# EAGLE design esc_interface (EAGLE 7.5.0)
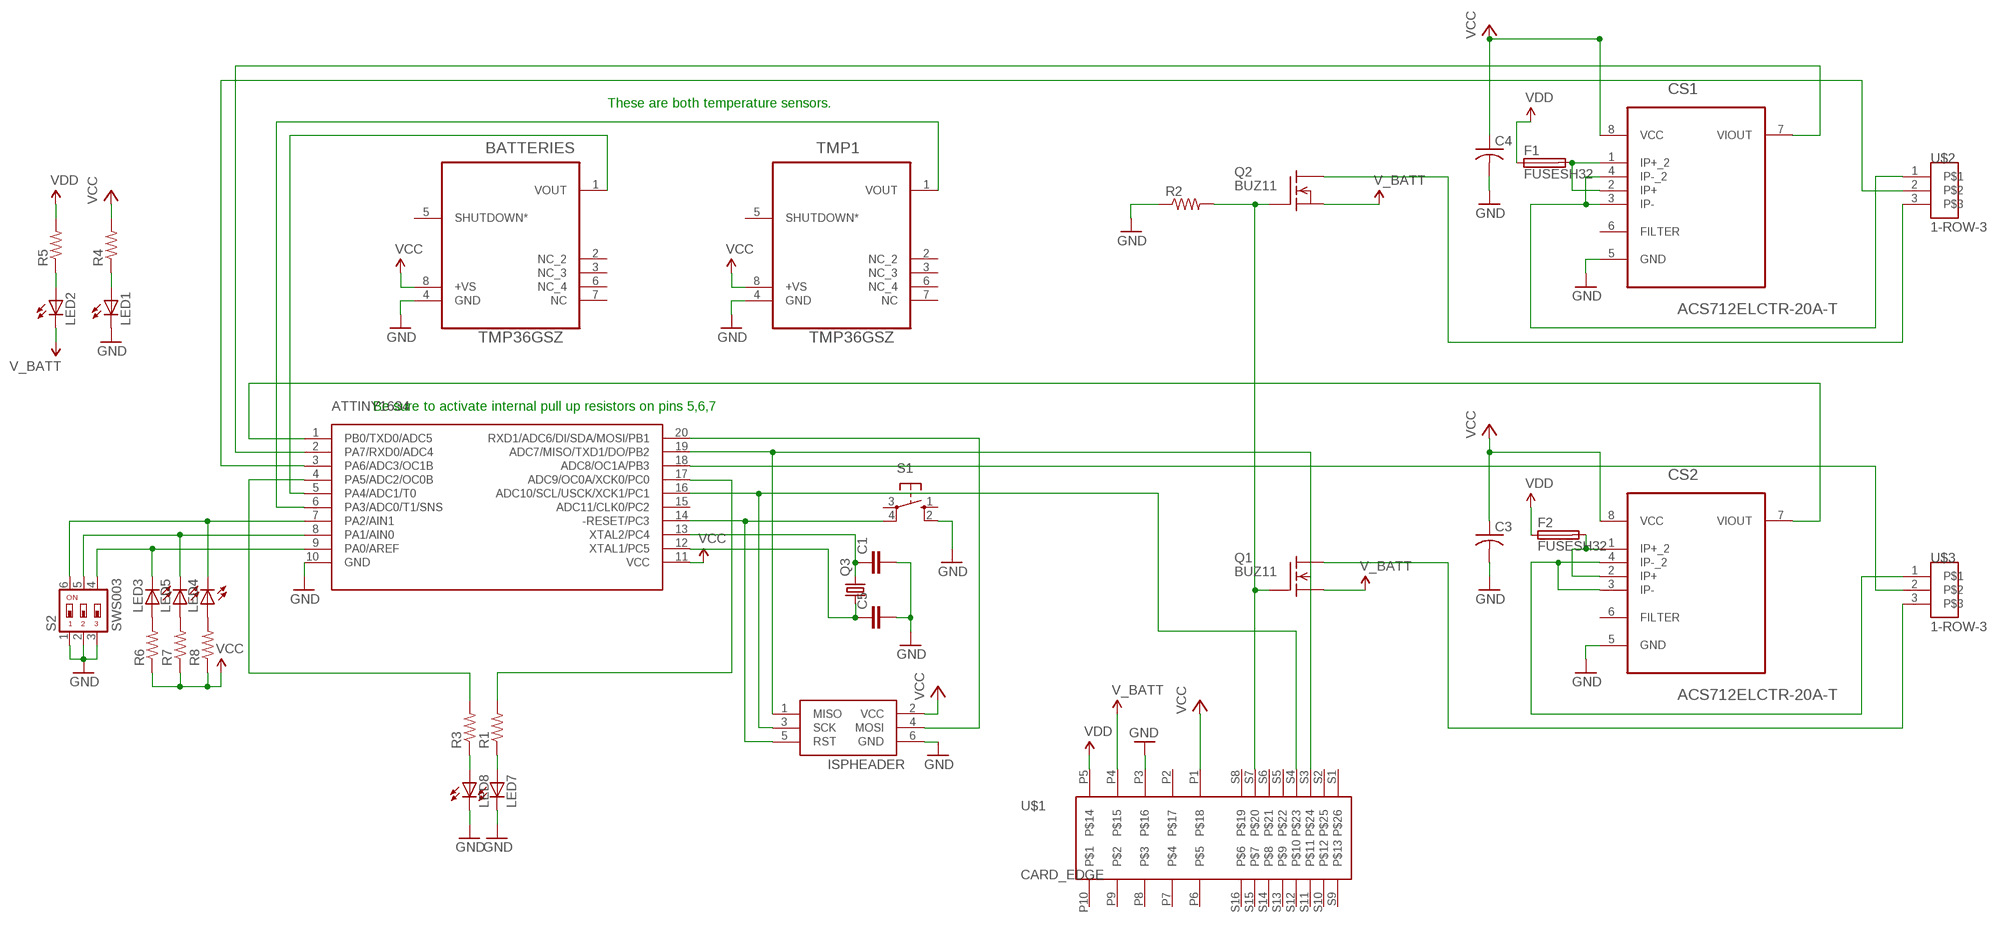
[diagram p0: schematic, sheet 1]

## Parts
ATTINY1634  ATTINY1634SOIC20  [SOIC20]
BATTERIES  TMP36GSZ  [SOIC127P600X175-8N]
C1  0.1UF-50V-20%(PTH)KIT-EZ  [CAP-PTH-SMALL-KIT]
C3  C-US025-030X050  [C025-030X050]
C4  C-US025-030X050  [C025-030X050]
C5  0.1UF-50V-20%(PTH)KIT-EZ  [CAP-PTH-SMALL-KIT]
CS1  ACS712ELCTR-20A-T  [SOIC127P600X175-8N]
CS2  ACS712ELCTR-20A-T  [SOIC127P600X175-8N]
F1  FUSESH32  [SH32]
F2  FUSESH32  [SH32]
ISPHEADER  AVRISP-6  [AVRISP]
LED1  LEDCHIP-LED0805  [CHIP-LED0805]
LED2  LEDCHIP-LED0805  [CHIP-LED0805]
LED3  LEDCHIP-LED0805  [CHIP-LED0805]
LED4  LEDCHIP-LED0805  [CHIP-LED0805]
LED5  LEDCHIP-LED0805  [CHIP-LED0805]
LED7  LEDCHIP-LED0805  [CHIP-LED0805]
LED8  LEDCHIP-LED0805  [CHIP-LED0805]
Q1  BUZ11  [TO220]
Q2  BUZ11  [TO220]
Q3  CRYSTALHC49S  [HC49/S]
R1  R-US_M2012  [M2012]
R2  R-US_M2012  [M2012]
R3  R-US_M2012  [M2012]
R4  R-US_M2012  [M2012]
R5  R-US_M2012  [M2012]
R6  R-US_M2012  [M2012]
R7  R-US_M2012  [M2012]
R8  R-US_M2012  [M2012]
S1  10-XX  [B3F-10XX]
S2  SWS003  [SMS-003]
TMP1  TMP36GSZ  [SOIC127P600X175-8N]
U$1  CARD_EDGE  [EDGE_CONNECTOR]
U$2  1-ROW-3  [1-ROW]
U$3  1-ROW-3  [1-ROW]

## Nets
GND: ATTINY1634.10(GND) BATTERIES.4(GND) C1.2 C3.2 C4.2 C5.2 CS1.5(GND) CS2.5(GND) ISPHEADER.6(GND) LED1.C LED7.C LED8.C R2.1 S1.2(S1) S2.1 S2.2 S2.3 TMP1.4(GND) U$1.P3
N$1: ATTINY1634.17(ADC9/OC0A/XCK0/PC0) R1.2
N$2: Q1.1(G) Q2.1(G) R2.2 U$1.S7
N$3: ATTINY1634.4(PA5/ADC2/OC0B) R3.2
N$4: Q1.2(D) U$3.3
N$5: Q2.2(D) U$2.3
N$6: ATTINY1634.19(ADC7/MISO/TXD1/DO/PB2) ISPHEADER.1(MISO) U$1.S3
N$7: CS2.3(IP-) CS2.4(IP-_2) U$3.1
N$8: ATTINY1634.1(PB0/TXD0/ADC5) CS2.7(VIOUT)
N$9: ATTINY1634.2(PA7/RXD0/ADC4) CS1.7(VIOUT)
N$10: ATTINY1634.5(PA4/ADC1/T0) BATTERIES.1(VOUT)
N$11: ATTINY1634.7(PA2/AIN1) LED4.C S2.6
N$12: ATTINY1634.8(PA1/AIN0) LED5.C S2.5
N$13: ATTINY1634.9(PA0/AREF) LED3.C S2.4
N$14: LED3.A R6.2
N$15: CS1.3(IP-) CS1.4(IP-_2) U$2.1
N$16: ATTINY1634.16(ADC10/SCL/USCK/XCK1/PC1) ISPHEADER.3(SCK) U$1.S4
N$17: ATTINY1634.14(-RESET/PC3) ISPHEADER.5(RST) S1.4(P1)
N$18: ATTINY1634.20(RXD1/ADC6/DI/SDA/MOSI/PB1) ISPHEADER.4(MOSI)
N$19: ATTINY1634.12(XTAL1/PC5) C5.1 Q3.1
N$20: ATTINY1634.13(XTAL2/PC4) C1.1 Q3.2
N$21: LED5.A R7.2
N$22: ATTINY1634.6(PA3/ADC0/T1/SNS) TMP1.1(VOUT)
N$23: LED4.A R8.2
N$24: ATTINY1634.3(PA6/ADC3/OC1B) U$2.2
N$25: LED2.A R5.1
N$26: ATTINY1634.18(ADC8/OC1A/PB3) U$3.2
N$27: LED8.A R3.1
N$28: LED7.A R1.1
N$32: LED1.A R4.1
N$35: CS1.1(IP+_2) CS1.2(IP+) F1.2A
N$36: CS2.1(IP+_2) CS2.2(IP+) F2.2A
V_BATT: LED2.C Q1.3(S) Q2.3(S) U$1.P4
VCC: ATTINY1634.11(VCC) BATTERIES.8(+VS) C3.1 C4.1 CS1.8(VCC) CS2.8(VCC) ISPHEADER.2(VCC) R4.2 R6.1 R7.1 R8.1 TMP1.8(+VS) U$1.P1
VDD: F1.1A F2.1A R5.2 U$1.P5
Unconnected: ATTINY1634.15(ADC11/CLK0/PC2) BATTERIES.2(NC_2) BATTERIES.3(NC_3) BATTERIES.5(SHUTDOWN*) BATTERIES.6(NC_4) BATTERIES.7(NC) CS1.6(FILTER) CS2.6(FILTER) S1.1(S) S1.3(P) TMP1.2(NC_2) TMP1.3(NC_3) TMP1.5(SHUTDOWN*) TMP1.6(NC_4) TMP1.7(NC) U$1.P2 U$1.P6 U$1.P7 U$1.P8 U$1.P9 U$1.P10 U$1.S1 U$1.S2 U$1.S5 U$1.S6 U$1.S8 U$1.S9 U$1.S10 U$1.S11 U$1.S12 U$1.S13 U$1.S14 U$1.S15 U$1.S16

## Notes on the sheet
- These are both temperature sensors.
- Be sure to activate internal pull up resistors on pins 5,6,7

## Library data of the parts
ATTINY1634 = attiny1634:ATTINY1634
BATTERIES TMP1 = ADI-Phase-2:TMP36GSZ: Voltage Output Temperature Sensors; MPN: TMP36GSZ; OC_FARNELL: 1661086; OC_NEWARK: 19M9014; PACKAGE: SOIC-8; SUPPLIER: Analog Devices
C1 C5 = SparkFun-Capacitors:0.1UF-50V-20%(PTH): CAP-08370; PROD_ID: CAP-08370
C3 C4 = rcl:C-US: CAPACITOR, American symbol
CS1 CS2 = Allegro_By_element14_Batch_1:ACS712ELCTR-20A-T: Linear Current Sensor; MPN: ACS712ELCTR-20A-T; OC_FARNELL: 1329624; OC_NEWARK: 31M3133; PACKAGE: SOIC-8; SUPPLIER: Allegro
F1 F2 = fuse:FUSE: Fuse; OC_FARNELL: unknown; OC_NEWARK: unknown
ISPHEADER = adafruit:AVRISP: AVR ISP HEADER Standard 6 pin header for AVR programming
LED1-LED5 LED7 LED8 = adafruit:LED: LED OSRAM: - CHIPLED LG R971, LG N971, LY N971, LG Q971, LY Q971, LO R971, LY R971 LH N974, LH R974 LS Q976, LO Q976, LY Q976 LO Q996 - Hyper CHIPLED LW Q18S LB Q993, LB Q99A, LB R99A - SideLED LS A670, LO A670, LY A670, LG A670, LP A670 LB A673, LV A673, LT A673, LW A673 LH A674 LY A675 LS A676, LA A676, LO A676, LY A676, LW A676 LS A679, LY A679, LG A679 - Hyper Micro SIDELED® LS Y876, LA Y876, LO Y876, LY Y876 LT Y87S - SmartLED LW L88C, LW L88S LB L89C, LB L89S, LG L890 LS L89K, LO L89K, LY L89K LS L896, LA L896, LO L896, LY L896 - TOPLED LS T670, LO T670, LY T670, LG T670, LP T670 LSG T670, LSP T670, LSY T670, LOP T670, LYG T670 LG T671, LOG T671, LSG T671 LB T673, LV T673, LT T673, LW T673 LH T674 LS T676, LA T676, LO T676, LY T676, LB T676, LH T676, LSB T676, LW T676 LB T67C, LV T67C, LT T67C, LS T67K, LO T67K, LY T67K, LW E67C LS E67B, LA E67B, LO E67B, LY E67B, LB E67C, LV E67C, LT E67C LW T67C LS T679, LY T679, LG T679 LS T770, LO T770, LY T770, LG T770, LP T770 LB T773, LV T773, LT T773, LW T773 LH T774 LS E675, LA E675, LY E675, LS T675 LS T776, LA T776, LO T776, LY T776, LB T776 LHGB T686 LT T68C, LB T68C - Hyper Mini TOPLED® LB M676 - Mini TOPLED Santana® LG M470 LS M47K, LO M47K, LY M47K Source: http://www.osram.convergy.de/
Q1 Q2 = transistor-fet:BUZ11: N-Channel Enhancement MOSFET 50V; 30A; 0,040Ohm
Q3 = crystal:CRYSTAL: CRYSTAL; OC_FARNELL: 1667008; OC_NEWARK: unknown
R1-R8 = adafruit:R-US_: RESISTOR, American symbol
S1 = switch-omron:10-XX: OMRON SWITCH; MPN: B3F-1000; OC_FARNELL: 176432; OC_NEWARK: 36M3542
S2 = smd-special:SWS003: SMD Dip Switch 3 pol.
U$1 = Molex_Edge:CARD_EDGE
U$2 U$3 = con-molex-mini-fit:1-ROW-3

## Board
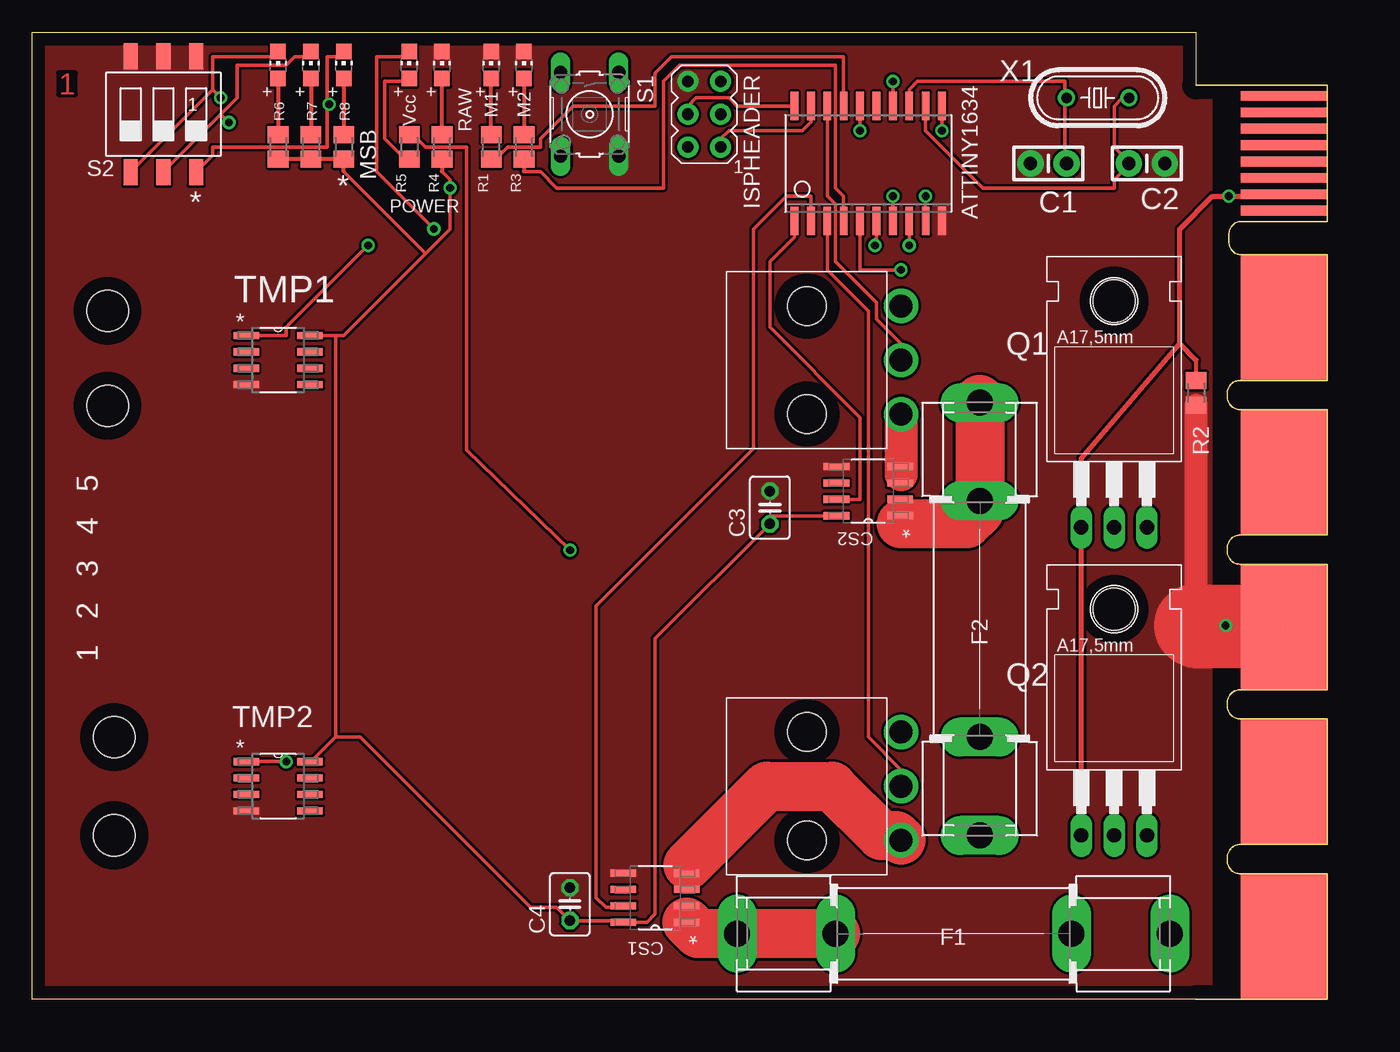
[diagram p1: board, top side]
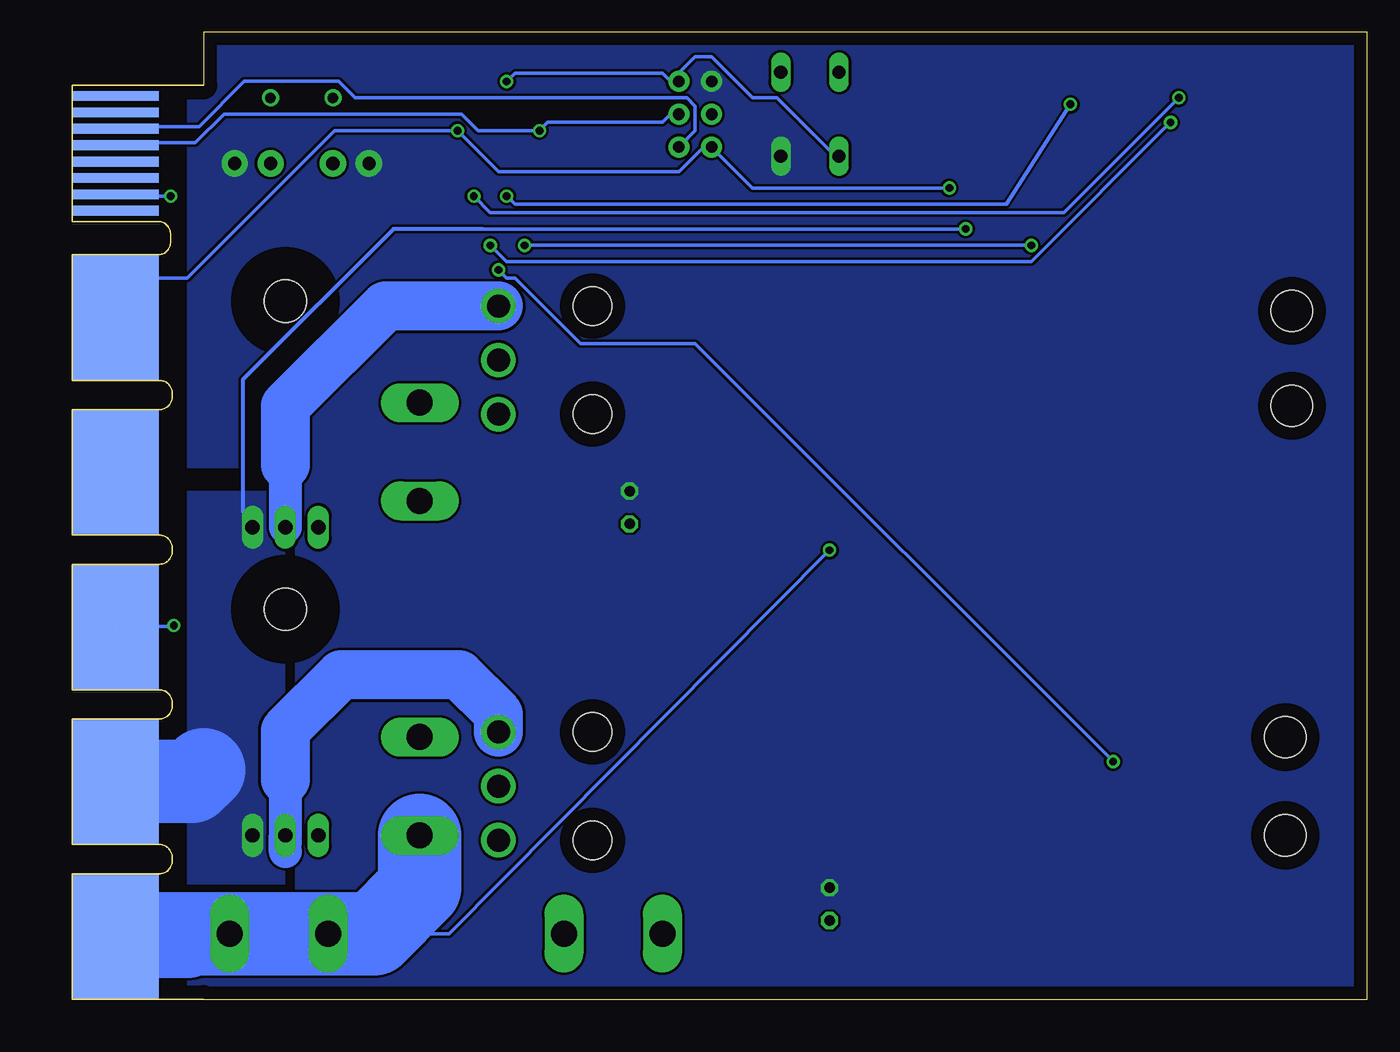
[diagram p2: board, bottom side, seen from below]

Size 100.33 x 74.93 mm. Coordinates in mm from the lower left corner, seen from the top.
Outline: 90.17,0 0,0 0,74.93 90.17,74.93 90.17,70.87
Copper layers (1*16): Top 0.035mm / dielectric 1.5mm / Bottom 0.035mm
Design rules "default": minimum track width 10mil, minimum drill 24mil, track to track 8mil, track to pad 8mil, pad to pad 8mil, via to via 8mil, smd to smd 8mil, copper to edge 40mil, drill to drill 8mil, minimum pad ring 10mil, minimum via ring 8mil, stop-mask expansion 4mil, vias tented up to drill 0mil, thermal gap 10mil
Holes 3.2 mm at 5.84,53.34 5.84,45.97 6.35,20.32 6.35,12.7

### Footprints (pad centres in the part's own frame; a part is rotated, then mirrored left to right if it is on the bottom)
SOIC20 = smd 0.6 x 2.2: 1 -1.905,-4.445; 2 -0.635,-4.445; 3 0.635,-4.445; 4 1.905,-4.445; 5 3.175,-4.445; 6 4.445,-4.445; 7 5.715,-4.445; 8 6.985,-4.445; 9 8.255,-4.445; 10 9.525,-4.445; 11 9.525,4.445; 12 8.255,4.445; 13 6.985,4.445; 14 5.715,4.445; 15 4.445,4.445; 16 3.175,4.445; 17 1.905,4.445; 18 0.635,4.445; 19 -0.635,4.445; 20 -1.905,4.445
SOIC127P600X175-8N = smd 1.981 x 0.559: 1 -2.464,1.905; 2 -2.464,0.635; 3 -2.464,-0.635; 4 -2.464,-1.905; 5 2.464,-1.905; 6 2.464,-0.635; 7 2.464,0.635; 8 2.464,1.905
CAP-PTH-SMALL-KIT = drill 1.016 pad 2.032: 1 -1.397,0; 2 1.397,0
C025-030X050 = drill 0.813 octagon: 1 -1.27,0; 2 1.27,0
SH32 = drill 2.007 long: 1A -16.764,0; 1B -9.144,0; 2A 9.144,0; 2B 16.764,0
AVRISP = drill 0.9 pad 1.626: 1 -1.27,2.54; 2 1.27,2.54; 3 -1.27,0; 4 1.27,0; 5 -1.27,-2.54; 6 1.27,-2.54
CHIP-LED0805 = smd 1.2 x 1.2: A 0,-1.05; C 0,1.05
TO220 = drill 1.118 long: 1 -2.54,-6.35; 2 0,-6.35; 3 2.54,-6.35 | hole 3.302: 0,11.176
HC49/S = drill 0.813: 1 -2.413,0; 2 2.413,0
M2012 = smd 1.3 x 1.6: 1 -0.95,0; 2 0.95,0
B3F-10XX = drill 1.016 long: 1 -3.251,2.261; 2 3.251,2.261; 3 -3.251,-2.261; 4 3.251,-2.261
SMS-003 = smd 1.092 x 2.007: 1 -2.54,-4.496; 2 0,-4.496; 3 2.54,-4.496; 4 2.54,4.496; 5 0,4.496; 6 -2.54,4.496
EDGE_CONNECTOR = smd 9.728 x 6.706 bottom: P1 52.87,3.35; P2 40.87,3.35; P3 28.87,3.35; P4 16.87,3.35 | smd 9.73 x 6.7 bottom: P5 4.87,3.35 | smd 9.728 x 6.706: P6 52.87,3.35; P7 40.87,3.35; P8 28.87,3.35; P9 16.87,3.35 | smd 9.73 x 6.7: P10 4.87,3.35 | smd 0.76 x 6.7 bottom: S1 69.99,3.35; S2 68.72,3.35; S3 67.45,3.35; S4 66.18,3.35; S5 64.91,3.35; S6 63.64,3.35; S7 62.37,3.35; S8 61.1,3.35 | smd 0.76 x 6.7: S9 69.99,3.35; S10 68.72,3.35; S11 67.45,3.35; S12 66.18,3.35; S13 64.91,3.35; S14 63.64,3.35; S15 62.37,3.35; S16 61.1,3.35
1-ROW = drill 1.778: 1 4.191,0; 2 0,0; 3 -4.191,0 | hole 2.997: -4.191,-7.29; 4.191,-7.29

### Placement (x,y rotation side)
ATTINY1634  60.96,64.77 0 top
BATTERIES  19.05,16.51 0 top
C1  78.74,64.77 180 top
C3  57.15,38.1 90 top
C4  41.66,7.37 90 top
C5  86.36,64.77 0 top
CS1  48.26,7.87 180 top
CS2  64.77,39.37 180 top
F1  71.37,5.08 180 top
F2  73.41,29.46 90 top
ISPHEADER  52.07,68.58 180 top
LED1  31.75,72.39 0 top
LED2  29.21,72.39 0 top
LED3  19.05,72.39 0 top
LED4  24.13,72.39 0 top
LED5  21.59,72.39 0 top
LED7  35.56,72.39 0 top
LED8  38.1,72.39 0 top
Q1  83.82,42.93 0 top
Q2  83.82,19.05 0 top
Q3  82.55,69.85 180 top
R1  35.56,66.04 270 top
R2  90.17,46.99 90 top
R3  38.1,66.04 270 top
R4  31.75,66.04 270 top
R5  29.21,66.04 90 top
R6  19.05,66.04 90 top
R7  21.59,66.04 90 top
R8  24.13,66.04 90 top
S1  43.18,68.58 270 top
S2  10.16,68.58 180 top
TMP1  19.05,49.53 0 top
U$1  100.33,0 90 top
U$2  67.31,16.51 270 top
U$3  67.31,49.53 270 top

### Tracks (layer width: path | path; a pad name or v marks a point on that pad's centre or on a via)
GND  (1 unrouted)
  Top 1.778: R2.1 90.17,28.96
  Top 6.452: 90.17,28.96 90.26,28.87 U$1.P3
  Bottom 0.254: U$1.P3 92.46,28.87 92.2,28.87
  pour Top (no thermals): 0,74.93 91.44,74.93 91.44,0 0,0
  pour Bottom (no thermals): 0,74.93 91.44,74.93 91.44,41.15 83.06,41.15 83.06,8.38 91.69,8.38 91.69,8.13 91.44,8.13 91.44,0 0,0
N$1
  Top 0.254: 35.56,64.77 36.83,66.04 39.37,66.04 39.37,66.68 41.91,69.22 48.26,69.22 48.26,71.75 49.53,73.03 62.87,73.03 ATTINY1634.17
  Top 0.305: R1.2 35.56,64.77
N$2  (via drill 0.61)
  Top 0.305: 90.17,49.53 R2.2
  Top 0.406: Q2.1 Q1.1 81.28,41.91 88.9,50.8 | 88.9,50.8 88.9,59.69 91.44,62.23 v92.71,62.23 96.84,62.23 U$1.S7 | 90.17,49.53 88.9,50.8
  Bottom 0.254: v92.71,62.23 96.52,62.23 U$1.S7
N$3
  Top 0.254: 38.1,64.13 39.37,64.13 40.64,62.87 48.9,62.87 48.9,71.12 50.16,72.39 62.23,72.39 62.23,62.87 62.87,62.23 ATTINY1634.4
  Top 0.305: R3.2 38.1,64.13
N$4
  Bottom 2.54: 83.82,41.4 Q1.2
  Bottom 3.81: U$3.3 76.07,53.72 83.82,45.97 83.82,41.4
N$5
  Bottom 2.54: 83.82,11.43 83.82,12.19 Q2.2 83.82,17.02
  Bottom 3.81: U$2.3 67.31,22.1 70.36,25.15 79.5,25.15 83.82,20.83 83.82,17.02
N$6
  Top 0.254: ATTINY1634.19 60.32,67.94 59.69,67.31 53.98,67.31 53.34,66.68 ISPHEADER.1
  Bottom 0.254: ISPHEADER.1 52.07,67.31 52.07,69.22 52.71,69.85 78.42,69.85 79.69,71.12 87,71.12 90.49,67.63 96.84,67.63 U$1.S3
N$7
  Top 0.254: CS2.3 67.31,40.01 67.31,40.64 | 67.31,41.27 CS2.4
  Top 2.54: U$3.1 67.31,41.27 67.31,40.64
N$8
  Top 0.254: CS2.7 64.13,38.73 64.13,45.09 57.15,52.07 57.15,57.15 59.05,59.05 ATTINY1634.1
N$9
  Top 0.254: ATTINY1634.2 60.32,62.23 58.42,62.23 55.88,59.69 55.88,42.67 43.69,30.48 43.69,7.87 44.45,7.11 45.67,7.11 CS1.7
N$10  (via drill 0.61)
  Top 0.254: v19.68,18.41 BATTERIES.1 | v67.31,56.51 64.13,56.51 ATTINY1634.5
  Bottom 0.254: v19.68,18.41 52.07,50.8 60.96,50.8 66.04,55.88 66.68,55.88 v67.31,56.51
N$11  (via drill 0.61)
  Top 0.254: 22.86,68.83 22.86,66.04 13.97,66.04 13.97,65.41 12.7,64.13 S2.6 | 22.86,68.83 22.86,73.03 24.13,73.03 LED4.C | v66.68,62.23 ATTINY1634.7 | v22.99,69.34 22.99,68.96 22.86,68.83
  Bottom 0.254: v66.68,62.23 66.04,61.6 27.94,61.6 v22.99,69.34
N$12  (via drill 0.61)
  Top 0.254: 14.61,68.58 10.16,64.13 S2.5 | 14.61,68.58 15.88,69.85 15.88,72.39 19.68,72.39 20.32,73.03 21.59,73.03 LED5.C | v67.94,58.42 ATTINY1634.8 | 14.61,68.58 v15.24,67.94
  Bottom 0.254: v67.94,58.42 66.68,57.15 26.04,57.15 v15.24,67.94
N$13  (via drill 0.61)
  Top 0.254: 13.97,70.49 13.97,73.03 19.05,73.03 LED3.C | 13.97,70.49 7.62,64.13 S2.4 | v69.22,62.23 ATTINY1634.9 | 13.97,70.49 v14.61,69.85
  Bottom 0.254: v69.22,62.23 67.94,60.96 23.49,60.96 v14.61,69.85
N$14
  Top 0.305: LED3.A R6.2
N$15
  Top 0.254: 50.8,10.41 50.72,10.34 CS1.4 50.8,9.7 50.8,8.38 50.72,8.46 CS1.3
  Top 3.81: 50.8,10.41 56.9,16.51 61.98,16.51 65.79,12.7 66.93,12.7 U$2.1
N$16  (via drill 0.61)
  Top 0.254: v64.13,67.31 ATTINY1634.16
  Bottom 0.254: ISPHEADER.3 53.98,68.58 54.61,67.94 63.5,67.94 v64.13,67.31 68.9,67.31 70.17,68.58 88.58,68.58 90.81,66.36 96.84,66.36 U$1.S4
N$17  (via drill 0.61)
  Top 0.254: v66.68,71.12 ATTINY1634.14
  Bottom 0.254: v66.68,71.12 66.04,71.75 54.61,71.75 53.98,71.12 | 53.98,71.12 52.07,73.03 50.8,73.03 47.63,69.85 45.72,69.85 41.27,65.41 S1.4 | 53.98,71.12 ISPHEADER.5
N$18
  Top 0.254: ATTINY1634.20 54.61,69.22 53.98,69.85 51.43,69.85 50.8,69.22 ISPHEADER.4
N$19
  Top 0.254: ATTINY1634.12 69.22,67.31 73.66,62.87 83.82,62.87 83.82,63.5 84.46,64.13 84.46,64.77 | 84.46,64.77 84.46,65.41 83.82,66.04 83.82,69.22 84.46,69.85 Q3.1 | 84.46,64.77 C5.1
N$20
  Top 0.254: ATTINY1634.13 67.94,70.49 68.58,71.12 80.01,71.12 80.01,69.85 | 80.01,69.85 80.01,64.77 C1.1 | 80.01,69.85 Q3.2
N$21
  Top 0.305: LED5.A R7.2
N$22  (via drill 0.61)
  Top 0.254: TMP1.1 19.68,51.43 19.68,52.07 v26.04,58.42 | v65.28,58.42 65.41,59.05 ATTINY1634.6
  Bottom 0.254: v65.28,58.42 v26.04,58.42
N$23
  Top 0.305: LED4.A R8.2
N$24
  Top 0.254: ATTINY1634.3 61.6,56.51 64.77,53.34 64.77,20.32 67.31,17.78 U$2.2
N$25
  Top 0.254: 29.21,64.77 27.3,66.68 27.3,71.12 29.21,71.12 LED2.A
  Top 0.305: 29.21,64.77 R5.1
N$26
  Top 0.254: ATTINY1634.18 61.6,62.23 62.23,61.6 62.23,57.15 65.41,53.98 65.41,52.71 67.31,50.8 U$3.2
N$27
  Top 0.305: LED8.A R3.1
N$28
  Top 0.305: R1.1 LED7.A
N$29  (via drill 0.6)
  other vias: 92.46,28.96
N$32
  Top 0.305: R4.1 LED1.A
N$35
  Top 0.254: CS1.1 50.67,5.97 50.55,5.84 50.8,5.84 52.07,4.57 52.07,5.89 CS1.2
  Top 3.81: F1.2A 51.61,5.08 CS1.1
N$36
  Top 0.254: 67.31,37.46 CS2.1 | 67.31,37.46 67.31,36.83 | 67.31,37.46 67.31,38.73 CS2.2
  Top 3.81: 67.31,36.83 72.39,36.83 73.41,37.85 F2.2A 73.41,46.48
V_BATT  (via drill 0.61)
  Top 0.254: v31.12,59.69 26.67,64.13 26.67,73.03 29.21,73.03 LED2.C
  Bottom 0.254: 68.58,59.69 v31.12,59.69
  Bottom 0.305: 68.58,59.69 75.44,59.69 87.12,48.01 87.12,37.85 Q1.3
  Bottom 6.452: U$1.P4 91.08,16.87 90.17,17.78
  pour Bottom (no thermals): 83.82,39.37 83.82,8.89 91.44,8.89 91.44,22.86 91.44,39.37
VCC  (via drill 0.61)
  Top 0.254: v70.49,67.31 ATTINY1634.11 | CS2.8 57.15,37.46 C3.1 48.26,27.94 48.26,6.6 47.63,5.97 CS1.8 45.67,6.1 C4.1 40.64,7.11 38.61,7.11 25.4,20.32 23.49,20.32 | 31.75,64.13 32.38,63.5 v32.38,62.87 32.38,59.69 30.48,57.79 | 30.48,57.79 24.13,51.43 23.49,51.43 | TMP1.8 23.49,51.43 | 23.49,20.32 21.59,18.41 BATTERIES.8 | 23.49,51.43 23.49,20.32 | 30.48,57.79 24.13,64.13
  Top 0.305: R4.2 31.75,64.13 | 24.13,64.13 R8.1 R7.1 R6.1
  Bottom 0.254: U$1.P1 96.52,53.34 93.98,55.88 91.44,55.88 80.01,67.31 v70.49,67.31 67.31,64.13 53.34,64.13 51.43,66.04 ISPHEADER.2 47.63,62.87 v32.38,62.87
VDD  (via drill 0.61)
  Top 0.254: 29.21,67.31 30.48,66.04 33.66,66.04 33.66,42.55 v41.66,34.8
  Top 0.305: R5.2 29.21,67.31
  Bottom 0.254: v41.66,34.8 71.12,5.08 76.96,5.08 | 91.44,5.08 F1.1A
  Bottom 3.81: 90.17,5.08 91.44,5.08
  Bottom 6.452: 91.44,5.08 91.44,4.87 U$1.P5 96.77,5.08 F1.1A 76.96,5.08 73.41,8.64 F2.1A

### Text on the board
Top: 1
tPlace: RAW | X1 | Vcc | M1 | M2 | MSB | * | C2 | * | POWER | C1 | 1 2 3 4 5 | TMP2